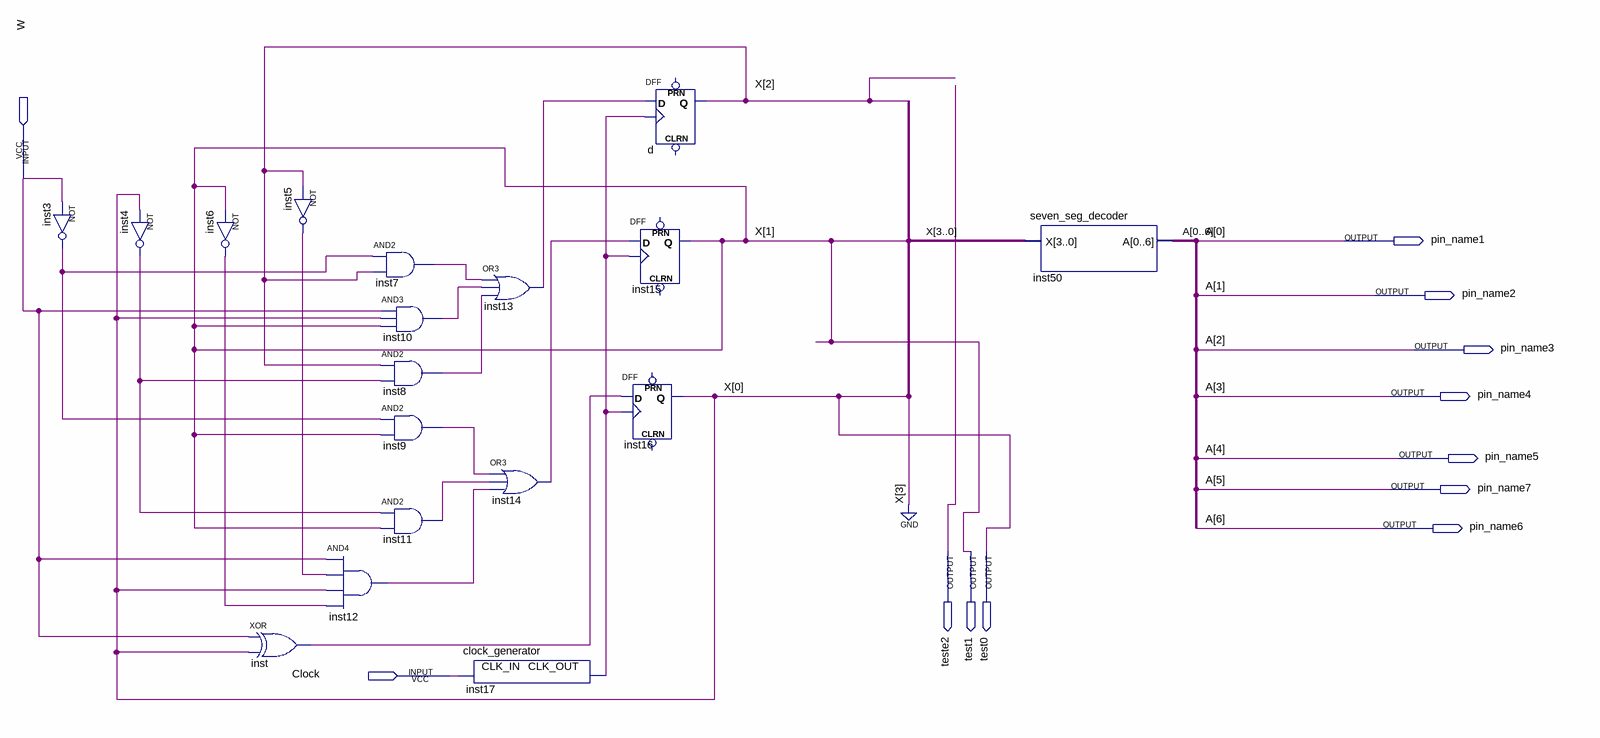
[diagram p0: schematic sheet]
// Quartus schematic lab11step1.bdf as structural Verilog: 18 symbols, 12 pins
module lab11step1 (
  input  W,
  input  Clock,
  output pin_name1,
  output pin_name2,
  output pin_name3,
  output pin_name4,
  output pin_name5,
  output pin_name7,
  output pin_name6,
  output teste2,
  output test1,
  output test0
);

  wire inst3_out, inst4_out, inst5_out, inst6_out, inst7_out, inst8_out, inst9_out, inst10_out, inst11_out,
       inst12_out, inst13_out, inst14_out, inst17_clk_out, inst_out;
  wire [2:2] X;

  not inst3 (inst3_out, W);
  not inst4 (inst4_out, test0);
  not inst6 (inst6_out, test1);
  xor inst (inst_out, W, test0);
  not inst5 (inst5_out, X[2]);
  and inst7 (inst7_out, inst3_out, X[2]);
  and inst12 (inst12_out, W, inst5_out, test0, inst6_out);
  and inst10 (inst10_out, W, test0, test1);
  and inst8 (inst8_out, X[2], inst4_out);
  and inst9 (inst9_out, inst3_out, test1);
  and inst11 (inst11_out, inst4_out, test1);
  or inst13 (inst13_out, inst7_out, inst10_out, inst8_out);
  or inst14 (inst14_out, inst9_out, inst11_out, inst12_out);
  clock_generator inst17 (.CLK_IN(Clock), .CLK_OUT(inst17_clk_out));
  DFF inst16 (.CLK(inst17_clk_out), .D(inst_out), .Q(test0));  // open: CLRN, PRN
  DFF d (.CLK(inst17_clk_out), .D(inst13_out), .Q(X[2]));  // open: CLRN, PRN
  DFF inst15 (.CLK(inst17_clk_out), .D(inst14_out), .Q(test1));  // open: CLRN, PRN
  seven_seg_decoder inst50 (
    .X({1'b0, X[2], test1, test0}),
    .A({pin_name1, pin_name2, pin_name3, pin_name4, pin_name5, pin_name7, pin_name6}));

  // Other names for the same wires on the sheet: A[6:0] = {pin_name6, pin_name7, pin_name5, pin_name4, pin_name3, pin_name2, pin_name1};
  //   X[1:0] = {test1, test0}
endmodule
